# Altium schematic sheet BSPD_System.SchDoc: QUTMS Shutdown V2.1 - BSPD System
size A3; Author: Jonn Dillon; Organization: QUT Motorsport; Address1: O-120; Address2: O Block; Address3: QUT Gardens Point; Address4: Brisbane, 4000; DocumentNumber: 4; Revision: 9; SheetNumber: 4; SheetTotal: 7
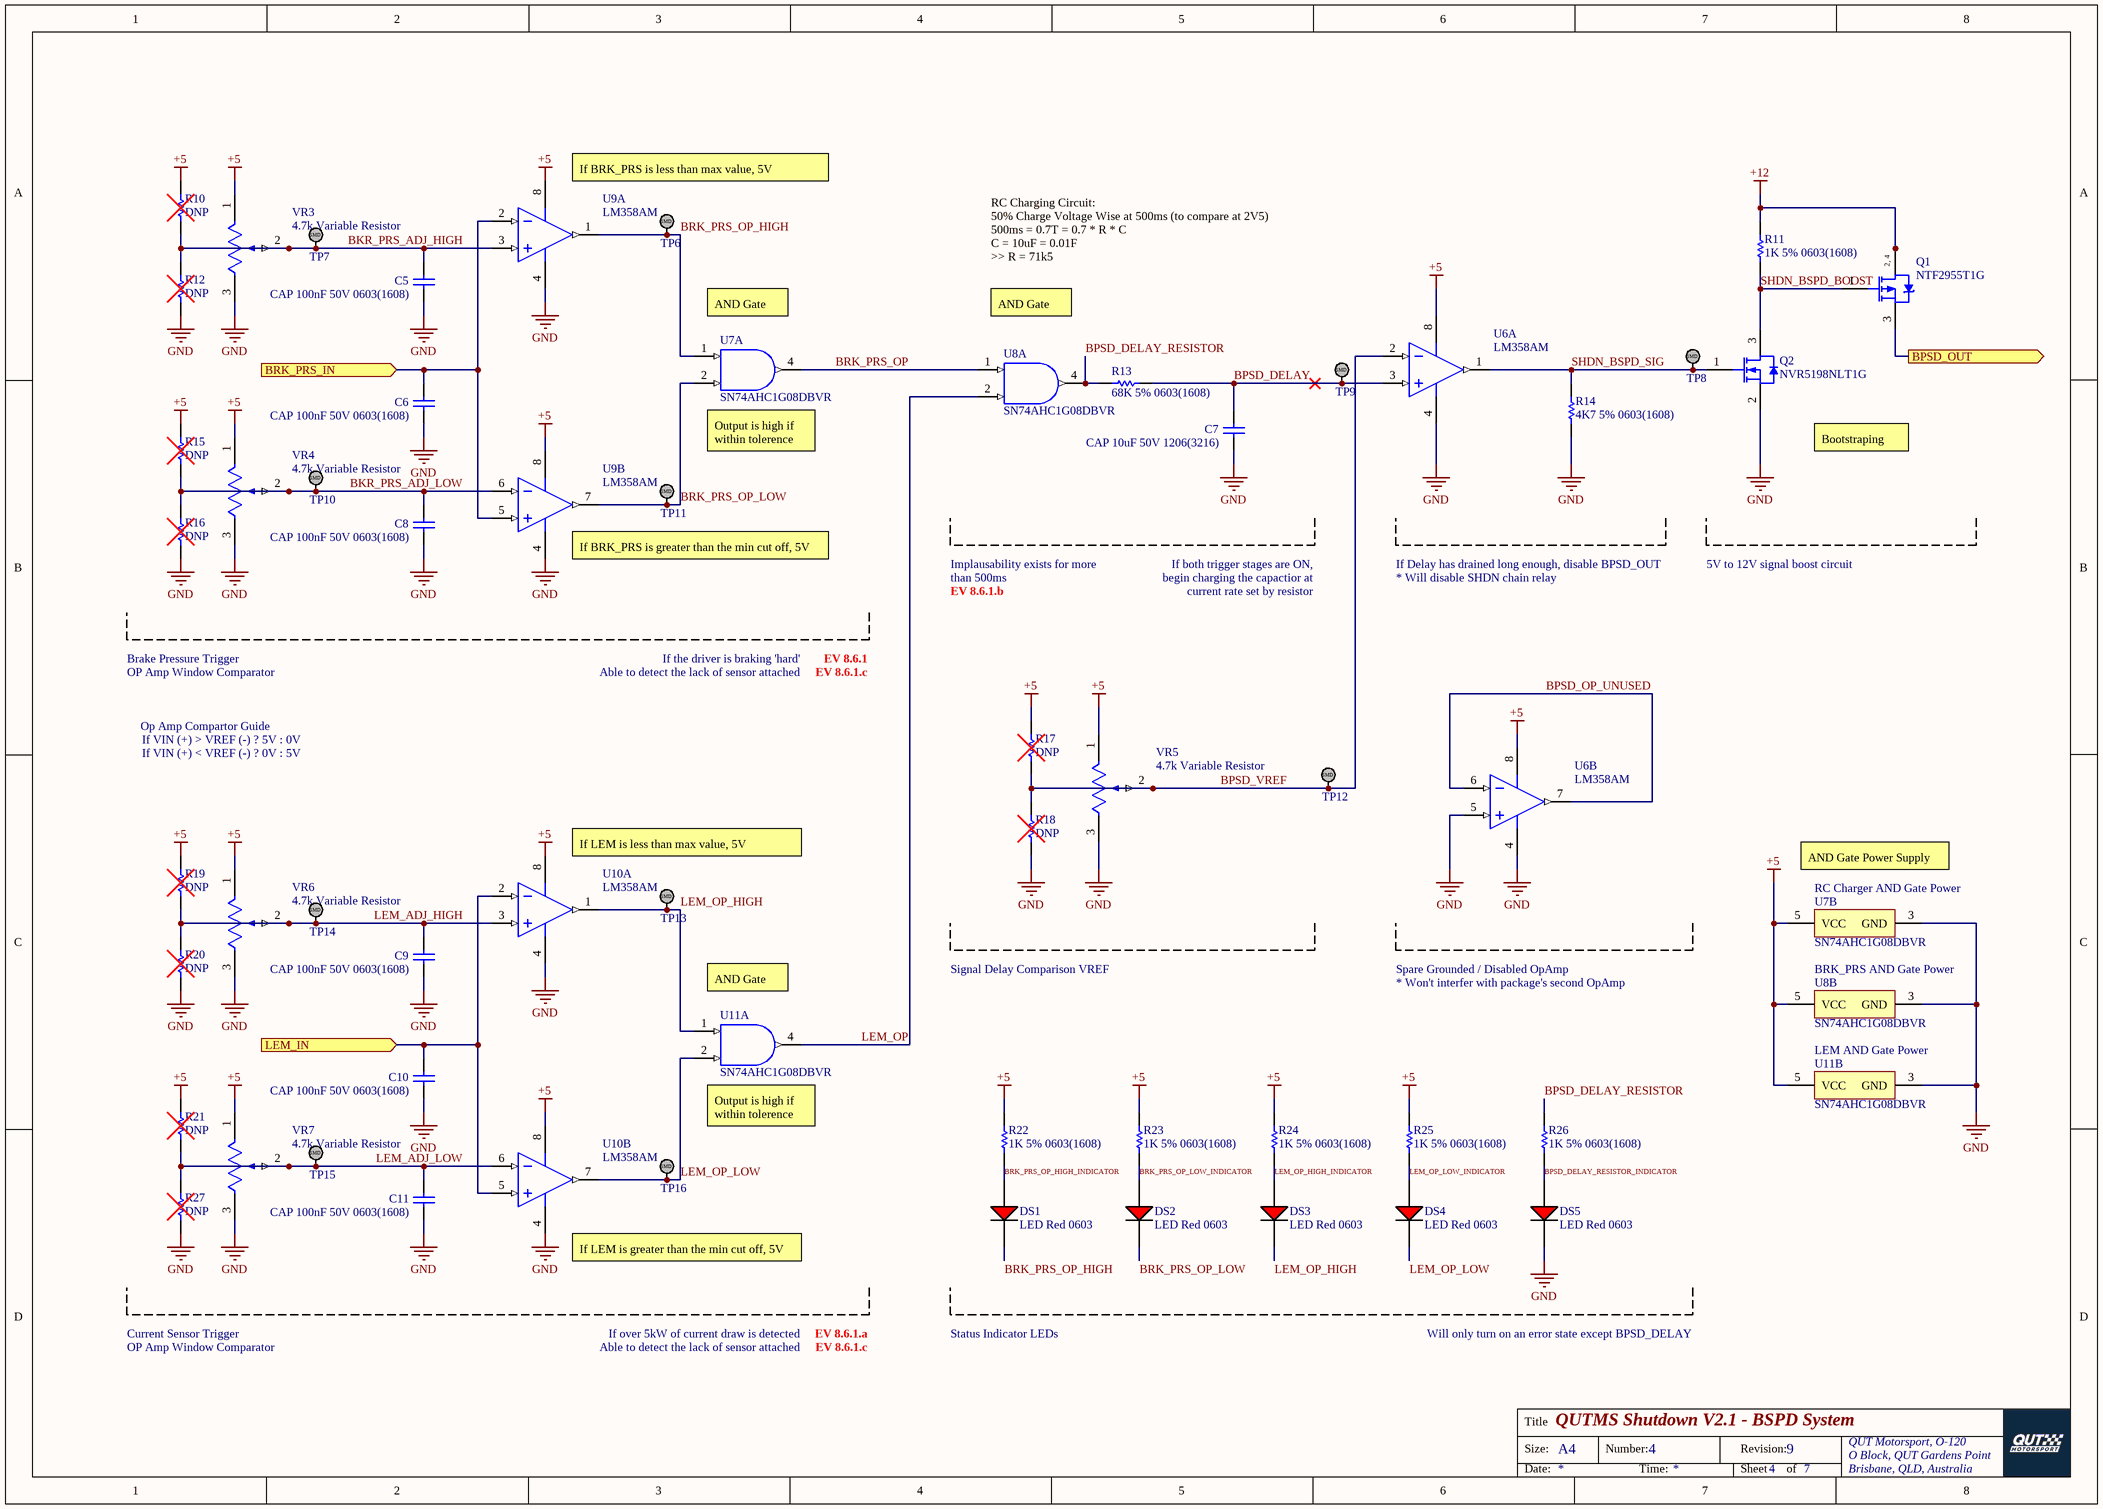
[diagram p0: BSPD_System.SchDoc]

## Parts
C5  CAP 100nF 50V 0603(1608)  [CAPC0603(1608)100_N]
C6  CAP 100nF 50V 0603(1608)  [CAPC0603(1608)100_N]
C7  CAP 10uF 50V 1206(3216)  [CAPC1206(3216)190_N]
C8  CAP 100nF 50V 0603(1608)  [CAPC0603(1608)100_N]
C9  CAP 100nF 50V 0603(1608)  [CAPC0603(1608)100_N]
C10  CAP 100nF 50V 0603(1608)  [CAPC0603(1608)100_N]
C11  CAP 100nF 50V 0603(1608)  [CAPC0603(1608)100_N]
DS1  LED Red 0603  [LED RED 0603]
DS2  LED Red 0603  [LED RED 0603]
DS3  LED Red 0603  [LED RED 0603]
DS4  LED Red 0603  [LED RED 0603]
DS5  LED Red 0603  [LED RED 0603]
Q1  NTF2955T1G  [ONSC-SOT-223-4-318E-04_V]
Q2  NVR5198NLT1G  [ONSC-SOT-23-3-318-08_V]
R10  DNP  [RESC0603(1608)_L]
R11  1K 5% 0603(1608)  [RESC0603(1608)_L]
R12  DNP  [RESC0603(1608)_L]
R13  68K 5% 0603(1608)  [RESC0603(1608)_N]
R14  4K7 5% 0603(1608)  [RESC0603(1608)_N]
R15  DNP  [RESC0603(1608)_L]
R16  DNP  [RESC0603(1608)_L]
R17  DNP  [RESC0603(1608)_L]
R18  DNP  [RESC0603(1608)_L]
R19  DNP  [RESC0603(1608)_L]
R20  DNP  [RESC0603(1608)_L]
R21  DNP  [RESC0603(1608)_L]
R22  1K 5% 0603(1608)  [RESC0603(1608)_L]
R23  1K 5% 0603(1608)  [RESC0603(1608)_L]
R24  1K 5% 0603(1608)  [RESC0603(1608)_L]
R25  1K 5% 0603(1608)  [RESC0603(1608)_L]
R26  1K 5% 0603(1608)  [RESC0603(1608)_L]
R27  DNP  [RESC0603(1608)_L]
TP6  TestPoint_SMD  [TestPointSMD]  (value not drawn)
TP7  TestPoint_SMD  [TestPointSMD]  (value not drawn)
TP8  TestPoint_SMD  [TestPointSMD]  (value not drawn)
TP9  TestPoint_SMD  [TestPointSMD]  (value not drawn)
TP10  TestPoint_SMD  [TestPointSMD]  (value not drawn)
TP11  TestPoint_SMD  [TestPointSMD]  (value not drawn)
TP12  TestPoint_SMD  [TestPointSMD]  (value not drawn)
TP13  TestPoint_SMD  [TestPointSMD]  (value not drawn)
TP14  TestPoint_SMD  [TestPointSMD]  (value not drawn)
TP15  TestPoint_SMD  [TestPointSMD]  (value not drawn)
TP16  TestPoint_SMD  [TestPointSMD]  (value not drawn)
U6  LM358AM  [D0008A_N]  (parts A,B of 2)
U7  SN74AHC1G08DBVR  [DBV0005A_N]  (parts A,B of 2)
U8  SN74AHC1G08DBVR  [DBV0005A_N]  (parts A,B of 2)
U9  LM358AM  [D0008A_N]  (parts A,B of 2)
U10  LM358AM  [D0008A_N]  (parts A,B of 2)
U11  SN74AHC1G08DBVR  [DBV0005A_N]  (parts A,B of 2)
VR3  4.7k Variable Resistor  [VG039NCHXTB472]
VR4  4.7k Variable Resistor  [VG039NCHXTB472]
VR5  4.7k Variable Resistor  [VG039NCHXTB472]
VR6  4.7k Variable Resistor  [VG039NCHXTB472]
VR7  4.7k Variable Resistor  [VG039NCHXTB472]

## Ports
BPSD_OUT (out), BRK_PRS_IN (in), LEM_IN (in)

## Nets
+5: R10.2 R15.2 R17.2 R19.2 R21.2 R22.2 R23.2 R24.2 R25.2 U6.8(V+) U7.5(VCC) U8.5(VCC) U9.8(V+) U10.8(V+) U11.5(VCC) VR3.1 VR4.1 VR5.1 VR6.1 VR7.1
+12: Q1.2(D) Q1.4(D) R11.2
GND: C5.2 C6.2 C7.1 C8.2 C9.2 C10.2 C11.2 DS5.2(C) Q2.2(S) R12.1 R14.1 R16.1 R18.1 R20.1 R27.1 U6.4(GND) U6.5(INB+) U7.3(GND) U8.3(GND) U9.4(GND) U10.4(GND) U11.3(GND) VR3.3 VR4.3 VR5.3 VR6.3 VR7.3
BKR_PRS_ADJ_HIGH: C5.1 R10.1 R12.2 TP7.1 U9.3(INA+) VR3.2
BKR_PRS_ADJ_LOW: C8.1 R15.1 R16.2 TP10.1 U9.6(INB-) VR4.2
BPSD_DELAY: C7.2 R13.2 TP9.1 U6.3(INA+)
BPSD_DELAY_RESISTOR: R13.1 R26.2 U8.4(Y)
BPSD_DELAY_RESISTOR_INDICATOR: DS5.1(A) R26.1
BPSD_OP_UNUSED: U6.6(INB-) U6.7(OUTB)
BPSD_OUT: Q1.3(S) ; port BPSD_OUT
BPSD_VREF: R17.1 R18.2 TP12.1 U6.2(INA-) VR5.2
BRK_PRS_IN: C6.1 U9.2(INA-) U9.5(INB+) ; port BRK_PRS_IN
BRK_PRS_OP: U7.4(Y) U8.1(A)
BRK_PRS_OP_HIGH: DS1.2(C) TP6.1 U7.1(A) U9.1(OUTA)
BRK_PRS_OP_HIGH_INDICATOR: DS1.1(A) R22.1
BRK_PRS_OP_LOW: DS2.2(C) TP11.1 U7.2(B) U9.7(OUTB)
BRK_PRS_OP_LOW_INDICATOR: DS2.1(A) R23.1
LEM_ADJ_HIGH: C9.1 R19.1 R20.2 TP14.1 U10.3(INA+) VR6.2
LEM_ADJ_LOW: C11.1 R21.1 R27.2 TP15.1 U10.6(INB-) VR7.2
LEM_IN: C10.1 U10.2(INA-) U10.5(INB+) ; port LEM_IN
LEM_OP: U8.2(B) U11.4(Y)
LEM_OP_HIGH: DS3.2(C) TP13.1 U10.1(OUTA) U11.1(A)
LEM_OP_HIGH_INDICATOR: DS3.1(A) R24.1
LEM_OP_LOW: DS4.2(C) TP16.1 U10.7(OUTB) U11.2(B)
LEM_OP_LOW_INDICATOR: DS4.1(A) R25.1
SHDN_BSPD_BOOST: Q1.1(G) Q2.3(D) R11.1
SHDN_BSPD_SIG: Q2.1(G) R14.2 TP8.1 U6.1(OUTA)

## Notes on the sheet
- (near U9) If BRK_PRS is less than max value, 5V
- (near U7) AND Gate
- RC Charging Circuit:
  50% Charge Voltage Wise at 500ms (to compare at 2V5)
  500ms = 0.7T = 0.7 * R * C
  C = 10uF = 0.01F
  >> R = 71k5
- AND Gate
- (near U7) Output is high if within tolerence
- Bootstraping
- (near U9) If BRK_PRS is greater than the min cut off, 5V
- Implausability exists for more
- than 500ms
- begin charging the capactior at
- If both trigger stages are ON,
- If Delay has drained long enough, disable BPSD_OUT
- * Will disable SHDN chain relay
- 5V to 12V signal boost circuit
- EV 8.6.1.b
- current rate set by resistor
- Brake Pressure Trigger
- OP Amp Window Comparator
- If the driver is braking 'hard'
- Able to detect the lack of sensor attached
- EV 8.6.1
- EV 8.6.1.c
- Op Amp Compartor Guide
- If VIN (+) > VREF (-) ? 5V : 0V
- If VIN (+) < VREF (-) ? 0V : 5V
- (near U10) If LEM is less than max value, 5V
- AND Gate Power Supply
- (near U7) RC Charger AND Gate Power
- (near U11) AND Gate
- Signal Delay Comparison VREF
- Spare Grounded / Disabled OpAmp
- * Won't interfer with package's second OpAmp
- BRK_PRS AND Gate Power
- LEM AND Gate Power
- (near U11) Output is high if within tolerence
- (near U10) If LEM is greater than the min cut off, 5V
- Current Sensor Trigger
- If over 5kW of current draw is detected
- EV 8.6.1.a
- Status Indicator LEDs
- Will only turn on an error state except BPSD_DELAY
- Title
- Size:
- A4
- Number:
- Revision:
- QUT Motorsport, O-120
- O Block, QUT Gardens Point
- Date:
- Time:
- Sheet
- of
- Brisbane, QLD, Australia
- (in symbol CMP-1058-00728-1) 2, 4
- (in symbol TestPoint_SMD) SMD

## Library data of the parts
C5 C6 C8-C11 = CMP-1035-02591-1: CAP 100nF 50V ±5% 0603 (1608 Metric) Thickness 1mm SMD; Tolerance: Â±5%; Case-Metric: 1608; Case-EIA: 0603; Rated Voltage: 50 V; Max Thickness: 1 mm; Technology: SMT; Value: 100nF
C7 = CMP-1037-04982-1: CAP 10uF 50V ±10% 1206 (3216 Metric) Thickness 1.9mm SMD; Case-EIA: 1206; Tolerance: Â±10%; Case-Metric: 3216; Technology: SMT; Max Thickness: 1.9 mm; Value: 10uF; Rated Voltage: 50 V
Q1 = CMP-1058-00728-1: Power MOSFET, -60 V, -2.6 A, Single P-Channel, 4-Pin SOT-223, Pb-Free, Tape and Reel; Manufacturer: On Semiconductor; Ciss Typ (pF): 492; Coss Typ (pF): 165; VGS(th) Max (V): 4; VGS Max (V): 20; ID Max (A): 2.6; Crss Typ (pF): 50; Channel Polarity: P Channel; V(BR)DSS Min (V): 60; Qrr Typ (nC): 0.139; Mounting Technology: Surface Mount; RoHS: Pb-Free; ComponentLink3URL: http://www.onsemi.com/pub_link/Collateral/318E-04.PDF; Packing: Tape and Reel; ComponentLink1URL: http://www.onsemi.com/; PackageReference: SOT-223-4-318E-04; Configuration: Single; PartNumber: NTF2955T1G; ComponentLink3Description: Package Specification; DatasheetVersion: Rev. 6; ComponentLink2Description: Datasheet; ComponentLink2URL: http://www.onsemi.com/pub_link/Collateral/NTF2955-D.PDF; PackageDescription: 4-Pin Small Outline Transistor, Body 6.5 x 3.5 mm, Pitch 2.3 mm; Package Type: SOT-223-4 / TO-261-4; ComponentLink1Description: Manufacturer URL; PackageVersion: Rev. N, 08/2009
Q2 = CMP-1058-00774-1: Power MOSFET, 60 V, 155 mOhm, Single N-Channel Logic Level, 3-Pin SOT-23, Pb-Free, Tape and Reel; Manufacturer: On Semiconductor; Ciss Typ (pF): 182; Coss Typ (pF): 25; ID Max (A): 2.2; Crss Typ (pF): 16; V(BR)DSS Min (V): 60; Qrr Typ (nC): 6; VGS Max (V): 20; VGS(th) Max (V): 2.5; Channel Polarity: N Channel; Package Type: SOT-23-3; ComponentLink1URL: http://www.onsemi.com/; ComponentLink2Description: Datasheet; ComponentLink1Description: Manufacturer URL; Mounting Technology: Surface Mount; Configuration: Single; Packing: Tape and Reel; RoHS: Pb-Free; ComponentLink3URL: http://www.onsemi.cn/pub_link/Collateral/318-08.PDF; PackageVersion: Rev. AP, 11/2009; PackageReference: SOT-23-3-318-08; DatasheetVersion: Rev. 1; PackageDescription: 3-Pin Small Outline Transistor, Body 2.92 x 1.3 mm, Pitch 0.95 mm; ComponentLink3Description: Package Specification; ComponentLink2URL: http://www.onsemi.com/pub_link/Collateral/NVR5198NL-D.PDF; PartNumber: NVR5198NLT1G
R10 R12 R15-R21 R27 = CMP-1591-00001-1: 0603 (1608 Metric) Chip Resistor; Case-Metric: 1608; Case-EIA: 0603; PackageReference: RESC0603(1608)
R11 R22-R26 = CMP-1012-00074-1: 1K 0.1W 5% 0603 (1608 Metric)  SMD; Case-EIA: 0603; Case-Metric: 1608; Value: 1000.00 Ohm; Technology: SMT; Tolerance: 5 %; Power: 0.1 W
R13 = CMP-1012-00118-1: 68K 0.1W 5% 0603 (1608 Metric)  SMD; Case-Metric: 1608; Case-EIA: 0603; Value: 68000.00 Ohm; Tolerance: 5 %; Power: 0.1 W; Technology: SMT
R14 = CMP-1012-00090-1: 4K7 0.1W 5% 0603 (1608 Metric)  SMD; Case-Metric: 1608; Value: 4700.00 Ohm; Case-EIA: 0603; Tolerance: 5 %; Technology: SMT; Power: 0.1 W
U6 U9 U10 = CMP-0055-00796-3: Low Power Dual Operational Amplifier, 8-pin Narrow SOIC; Manufacturer: Texas Instruments; CompType: Amplifiers; PackageTopMarking: NSZXTT*LM*358AM; PowerWise: N; Code_JEDEC: MS-012-AA; RoHS: N; PinCount: 8; Package Reference: D0008A; ComponentLink1Description: Datasheet URL; ComponentLink1URL: http://www.ti.com/general/docs/lit/getliterature.tsp?genericPartNumber=LM358-N&fileType=pdf; Code_IPC: SOIC127P600-8; PackageDescription: SOIC Narrow, 4.9 x 3.9 x 1.45mm, 8 Lead, 1.27mm Pitch
U7 U8 U11 = CMP-0859-00043-3: Single 2-Input Positive-AND Gate, DBV0005A, LARGE T&R; Manufacturer: Texas Instruments; Logic: True; Schmitt Trigger: No; Bits(#): 1; Voltage(Nom)(V): 3.3,5; F @ Nom Voltage(Max)(Mhz): 75; Output Type: CMOS; ICC @ Nom Voltage(Max)(mA): 0.01; Output Drive (IOL/IOH)(Max)(mA): 50/-50; VCC(Max)(V): 5.5; Technology Family: AHC; Gate Type: AND; Rating: Catalog; VCC(Min)(V): 2; tpd @ Nom Voltage(Max)(ns): 12.3,7.9; Generic Part Number: SN74AHC1G08; Operating Temperature Range(C): -55 to 125; PackageReference: DBV0005A; DatasheetVersion: SCLS314N; Input Type: CMOS; Sub-Family: AND Gate; 3-State Output: No
VR3-VR7 = 4.7k Variable Resistor: 4k7 ±25% ±250 ppm/°C SMD Variable Resistors RoHS | VG039NCHXTB472; ComponentLink1Description: LCSC; ComponentLink1URL: https://lcsc.com/product-detail/Variable-Resistors_HDK-Hokuriku-Elec-Industry-VG039NCHXTB472_C128555.html